# Altium schematic sheet SHDN-S04-V00-Connector.SchDoc
size A3
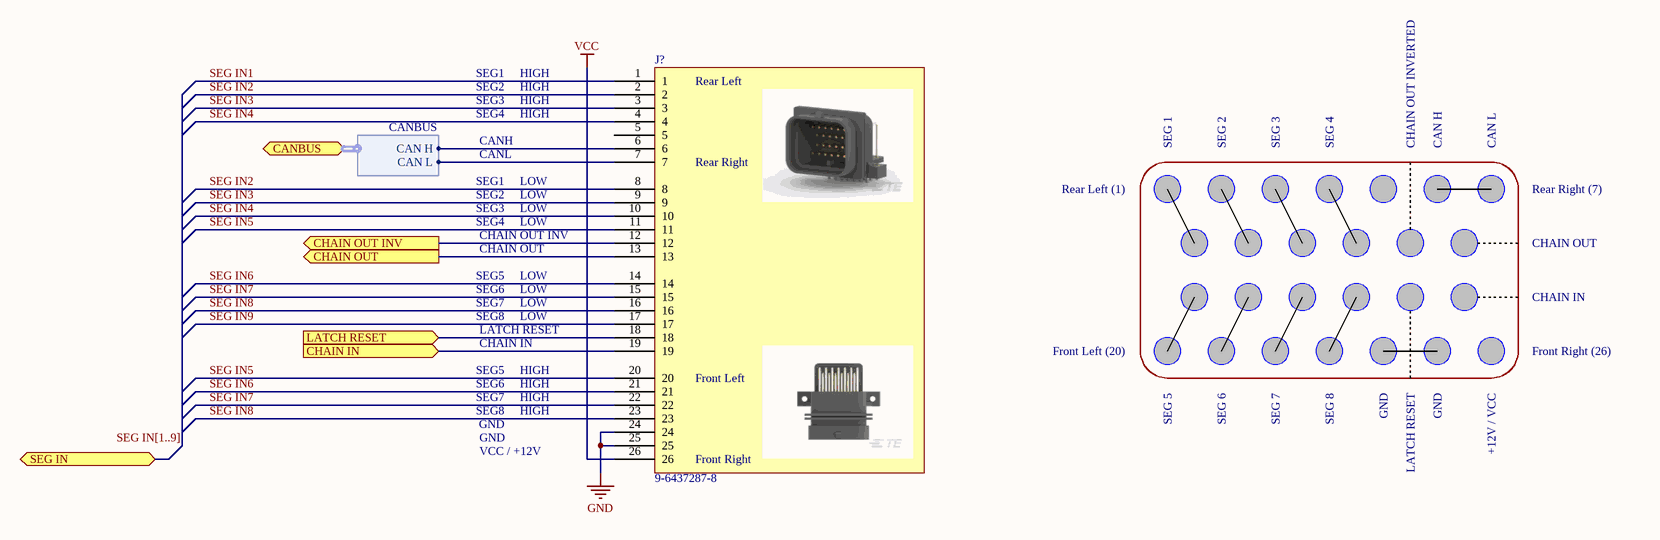
[diagram p0: SHDN-S04-V00-Connector.SchDoc]

## Parts
J?  9-6437287-8  [SUPERSEAL RIGHT 26WAY]

## Ports
CANBUS (bidir, harness CANBUS), CHAIN IN (in), CHAIN OUT (out), CHAIN OUT INV (out), LATCH RESET (in), SEG IN (bidir)

## Harnesses
CANBUS: CAN H, CAN L

## Nets
GND: J?.24 J?.25
VCC: J?.26
CHAIN IN: J?.19 ; port CHAIN IN
CHAIN OUT: J?.13 ; port CHAIN OUT
CHAIN OUT INV: J?.12 ; port CHAIN OUT INV
LATCH RESET: J?.18 ; port LATCH RESET
SEG IN1: J?.1
SEG IN2: J?.2 J?.8
SEG IN3: J?.3 J?.9
SEG IN4: J?.4 J?.10
SEG IN5: J?.11 J?.20
SEG IN6: J?.14 J?.21
SEG IN7: J?.15 J?.22
SEG IN8: J?.16 J?.23
SEG IN9: J?.17
NetJ?_6: J?.6 ; port CANBUS.CAN H
NetJ?_7: J?.7 ; port CANBUS.CAN L

Not connected (* = marked no-connect by the designer): J? 5

## Buses and harness runs
bus SEG IN[1..9] = port SEG IN

## Notes on the sheet
- SEG1
- SEG2
- HIGH
- CANH
- CANL
- SEG3
- SEG4
- SEG 1
- SEG 2
- SEG 3
- SEG 4
- CHAIN OUT INVERTED
- CAN H
- CAN L
- LOW
- Rear Left (1)
- Rear Right (7)
- CHAIN OUT
- CHAIN OUT INV
- SEG6
- SEG5
- CHAIN IN
- LATCH RESET
- SEG7
- SEG8
- Front Left (20)
- Front Right (26)
- GND
- SEG 5
- SEG 6
- SEG 7
- SEG 8
- +12V / VCC
- VCC / +12V
- Revision History:
- Sheet Title:
- Rev
- Date
- Description
- Project:
- Size:
- Drawn By:
- A3
- Number:
- Revision:
- Sheet
- Version:
- of
- QUT Motorsport
- O-120, Gardens Point
- 2 George Street
- Brisbane, QLD 4000
- Australia
- Print Date:
- Print Time:
- File Name:
- (in symbol 9-6437287-8) Rear Left; Rear Right; Front Left; Front Right

## Library data of the parts
J? = 9-6437287-8: Connector Header Through Hole, Right Angle 26 position 0.118" (3.00mm)